# EAGLE schematic MotorControl (EAGLE 9.2.1)
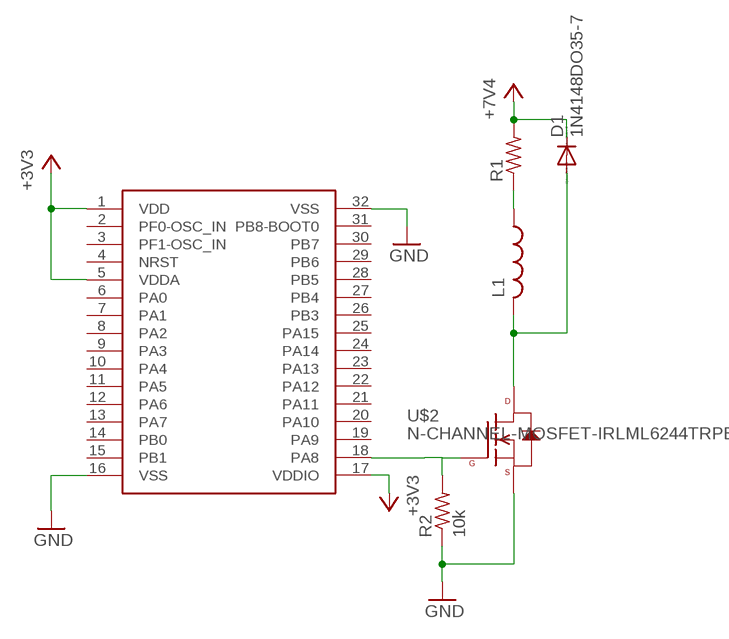
[diagram p0: schematic, sheet 1]

## Parts
D1  1N4148DO35-7  [DO35-7]
L1  L-US0204/7  [0204/7]
R1  R-US_0207/2V  [0207/2V]
R2  10k  R-US_0207/2V  [0207/2V]
U$1  STM32F042K6LQFP32  [QFP80P900X900X120-32]
U$2  N-CHANNEL-MOSFET-IRLML6244TRPBF  [SOT23-3]

## Nets
+3V3: U$1.1(VDD) U$1.5(VDDA) U$1.17(VDDIO)
+5V: D1.C R1.2 ; supply symbol labelled +7V4
GND: R2.1 U$1.16(VSS) U$1.32(VSS) U$2.2(S)
N$2: L1.1 R1.1
N$3: R2.2 U$1.18(PA8) U$2.1(G)
N$5: D1.A L1.2 U$2.3(D)
Unconnected: U$1.2(PF0-OSC_IN) U$1.3(PF1-OSC_IN) U$1.4(NRST) U$1.6(PA0) U$1.7(PA1) U$1.8(PA2) U$1.9(PA3) U$1.10(PA4) U$1.11(PA5) U$1.12(PA6) U$1.13(PA7) U$1.14(PB0) U$1.15(PB1) U$1.19(PA9) U$1.20(PA10) U$1.21(PA11) U$1.22(PA12) U$1.23(PA13) U$1.24(PA14) U$1.25(PA15) U$1.26(PB3) U$1.27(PB4) U$1.28(PB5) U$1.29(PB6) U$1.30(PB7) U$1.31(PB8-BOOT0)

## Library data of the parts
D1 = diode:1N4148: DIODE high speed (Philips)
L1 = rcl:L-US: INDUCTOR, American symbol; SPICEPREFIX: L
R1 R2 = resistor:R-US_: RESISTOR, American symbol
U$1 = AP_quad:STM32F042K6
U$2 = AP_quad:N-CHANNEL-MOSFET: N-Channel MOSFET Mode Field Effect Transistor; DATASHEET: http://www.mouser.com/ds/2/196/irlml6244pbf-936666.pdf; MOUSER: 942-IRLML6244TRPBF; URL: http://www.mouser.com/Search/ProductDetail.aspx?R=IRLML6244TRPBFvirtualkey57370000virtualkey942-IRLML6244TRPBF